# Altium schematic sheet 45-RELAY_MUX_SWITCH.SchDoc
size 594 x 420 mm
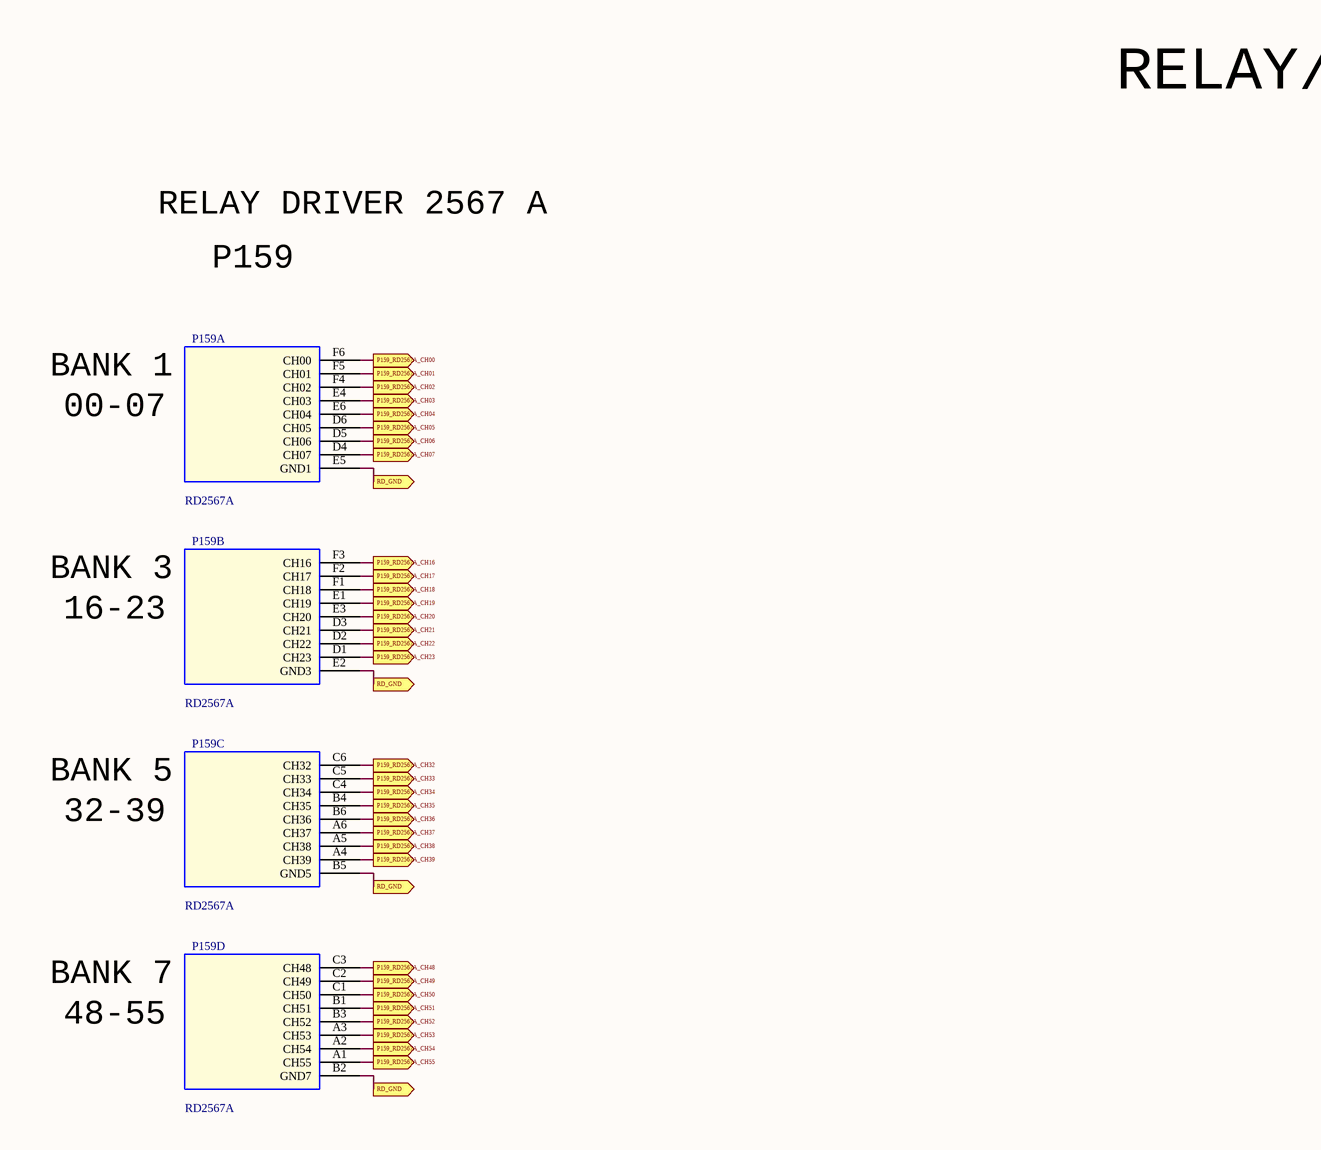
[diagram p0: 45-RELAY_MUX_SWITCH.SchDoc, top left]
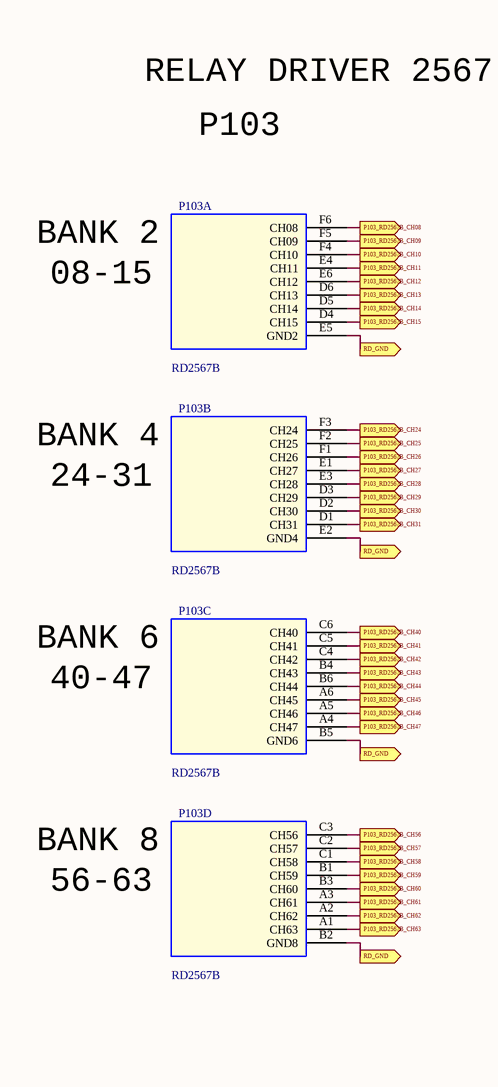
[diagram p1: 45-RELAY_MUX_SWITCH.SchDoc, bottom left]
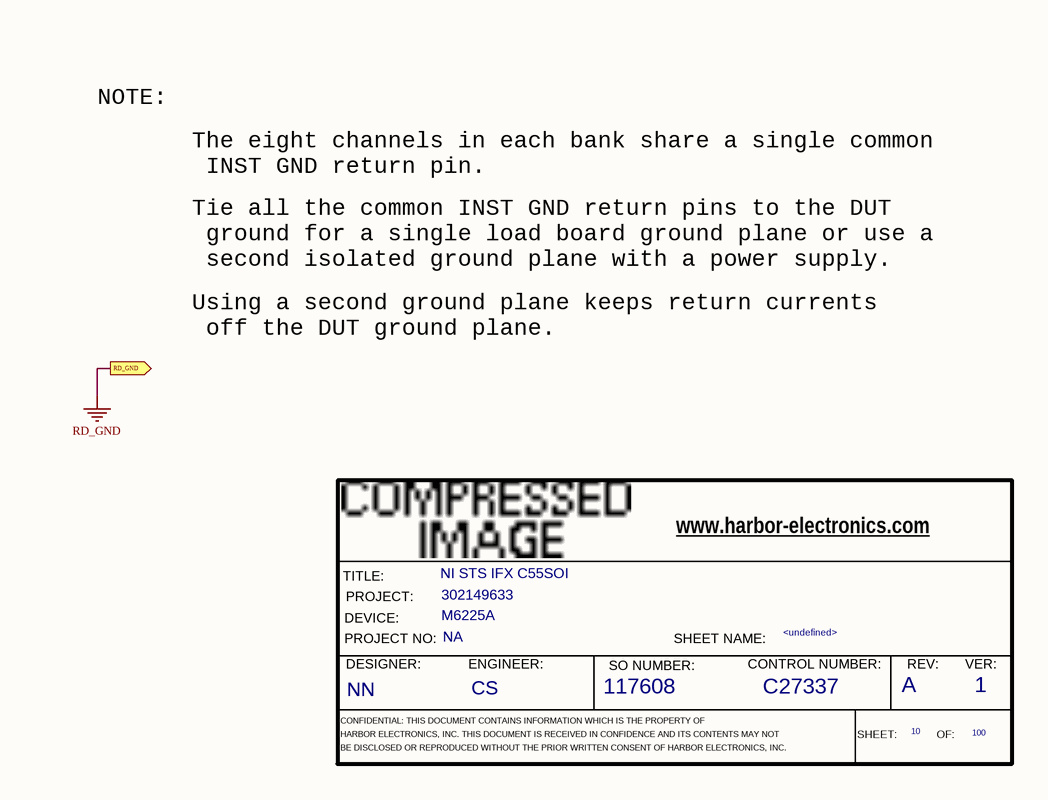
[diagram p2: 45-RELAY_MUX_SWITCH.SchDoc, bottom right]

## Parts
*  RevCode: A  Title: NI STS IFX C55SOI  Page Number: 10  Page Count: 100  Engineer: CS  Designer: NN  SO Number: 117608  Control Number: C27337  Version: 1  Page Name: <undefined>  PROJECT: 302149633  DEVICE: M6225A  PROJECT NO.: NA  (hidden comment: HE_DEFAULT)  (graphical)
P103  RD2567B  [285092A-08_36PIN]  (parts A,B,C,D of 4)
P159  RD2567A  [285092A-08_36PIN]  (parts A,B,C,D of 4)

## Ports
P103_RD2567B_CH08 (out), P103_RD2567B_CH09 (out), P103_RD2567B_CH10 (out), P103_RD2567B_CH11 (out), P103_RD2567B_CH12 (out), P103_RD2567B_CH13 (out), P103_RD2567B_CH14 (out), P103_RD2567B_CH15 (out), P103_RD2567B_CH24 (out), P103_RD2567B_CH25 (out), P103_RD2567B_CH26 (out), P103_RD2567B_CH27 (out), P103_RD2567B_CH28 (out), P103_RD2567B_CH29 (out), P103_RD2567B_CH30 (out), P103_RD2567B_CH31 (out), P103_RD2567B_CH40 (out), P103_RD2567B_CH41 (out), P103_RD2567B_CH42 (out), P103_RD2567B_CH43 (out), P103_RD2567B_CH44 (out), P103_RD2567B_CH45 (out), P103_RD2567B_CH46 (out), P103_RD2567B_CH47 (out), P103_RD2567B_CH56 (out), P103_RD2567B_CH57 (out), P103_RD2567B_CH58 (out), P103_RD2567B_CH59 (out), P103_RD2567B_CH60 (out), P103_RD2567B_CH61 (out), P103_RD2567B_CH62 (out), P103_RD2567B_CH63 (out), P159_RD2567A_CH00 (out), P159_RD2567A_CH01 (out), P159_RD2567A_CH02 (out), P159_RD2567A_CH03 (out), P159_RD2567A_CH04 (out), P159_RD2567A_CH05 (out), P159_RD2567A_CH06 (out), P159_RD2567A_CH07 (out), P159_RD2567A_CH16 (out), P159_RD2567A_CH17 (out), P159_RD2567A_CH18 (out), P159_RD2567A_CH19 (out), P159_RD2567A_CH20 (out), P159_RD2567A_CH21 (out), P159_RD2567A_CH22 (out), P159_RD2567A_CH23 (out), P159_RD2567A_CH32 (out), P159_RD2567A_CH33 (out), P159_RD2567A_CH34 (out), P159_RD2567A_CH35 (out), P159_RD2567A_CH36 (out), P159_RD2567A_CH37 (out), P159_RD2567A_CH38 (out), P159_RD2567A_CH39 (out), P159_RD2567A_CH48 (out), P159_RD2567A_CH49 (out), P159_RD2567A_CH50 (out), P159_RD2567A_CH51 (out), P159_RD2567A_CH52 (out), P159_RD2567A_CH53 (out), P159_RD2567A_CH54 (out), P159_RD2567A_CH55 (out), RD_GND (out)

## Nets
RD_GND: P103.B2(GND8) P103.B5(GND6) P103.E2(GND4) P103.E5(GND2) P159.B2(GND7) P159.B5(GND5) P159.E2(GND3) P159.E5(GND1) ; port RD_GND
P103_RD2567B_CH08: P103.F6(CH08) ; port P103_RD2567B_CH08
P103_RD2567B_CH09: P103.F5(CH09) ; port P103_RD2567B_CH09
P103_RD2567B_CH10: P103.F4(CH10) ; port P103_RD2567B_CH10
P103_RD2567B_CH11: P103.E4(CH11) ; port P103_RD2567B_CH11
P103_RD2567B_CH12: P103.E6(CH12) ; port P103_RD2567B_CH12
P103_RD2567B_CH13: P103.D6(CH13) ; port P103_RD2567B_CH13
P103_RD2567B_CH14: P103.D5(CH14) ; port P103_RD2567B_CH14
P103_RD2567B_CH15: P103.D4(CH15) ; port P103_RD2567B_CH15
P103_RD2567B_CH24: P103.F3(CH24) ; port P103_RD2567B_CH24
P103_RD2567B_CH25: P103.F2(CH25) ; port P103_RD2567B_CH25
P103_RD2567B_CH26: P103.F1(CH26) ; port P103_RD2567B_CH26
P103_RD2567B_CH27: P103.E1(CH27) ; port P103_RD2567B_CH27
P103_RD2567B_CH28: P103.E3(CH28) ; port P103_RD2567B_CH28
P103_RD2567B_CH29: P103.D3(CH29) ; port P103_RD2567B_CH29
P103_RD2567B_CH30: P103.D2(CH30) ; port P103_RD2567B_CH30
P103_RD2567B_CH31: P103.D1(CH31) ; port P103_RD2567B_CH31
P103_RD2567B_CH40: P103.C6(CH40) ; port P103_RD2567B_CH40
P103_RD2567B_CH41: P103.C5(CH41) ; port P103_RD2567B_CH41
P103_RD2567B_CH42: P103.C4(CH42) ; port P103_RD2567B_CH42
P103_RD2567B_CH43: P103.B4(CH43) ; port P103_RD2567B_CH43
P103_RD2567B_CH44: P103.B6(CH44) ; port P103_RD2567B_CH44
P103_RD2567B_CH45: P103.A6(CH45) ; port P103_RD2567B_CH45
P103_RD2567B_CH46: P103.A5(CH46) ; port P103_RD2567B_CH46
P103_RD2567B_CH47: P103.A4(CH47) ; port P103_RD2567B_CH47
P103_RD2567B_CH56: P103.C3(CH56) ; port P103_RD2567B_CH56
P103_RD2567B_CH57: P103.C2(CH57) ; port P103_RD2567B_CH57
P103_RD2567B_CH58: P103.C1(CH58) ; port P103_RD2567B_CH58
P103_RD2567B_CH59: P103.B1(CH59) ; port P103_RD2567B_CH59
P103_RD2567B_CH60: P103.B3(CH60) ; port P103_RD2567B_CH60
P103_RD2567B_CH61: P103.A3(CH61) ; port P103_RD2567B_CH61
P103_RD2567B_CH62: P103.A2(CH62) ; port P103_RD2567B_CH62
P103_RD2567B_CH63: P103.A1(CH63) ; port P103_RD2567B_CH63
P159_RD2567A_CH00: P159.F6(CH00) ; port P159_RD2567A_CH00
P159_RD2567A_CH01: P159.F5(CH01) ; port P159_RD2567A_CH01
P159_RD2567A_CH02: P159.F4(CH02) ; port P159_RD2567A_CH02
P159_RD2567A_CH03: P159.E4(CH03) ; port P159_RD2567A_CH03
P159_RD2567A_CH04: P159.E6(CH04) ; port P159_RD2567A_CH04
P159_RD2567A_CH05: P159.D6(CH05) ; port P159_RD2567A_CH05
P159_RD2567A_CH06: P159.D5(CH06) ; port P159_RD2567A_CH06
P159_RD2567A_CH07: P159.D4(CH07) ; port P159_RD2567A_CH07
P159_RD2567A_CH16: P159.F3(CH16) ; port P159_RD2567A_CH16
P159_RD2567A_CH17: P159.F2(CH17) ; port P159_RD2567A_CH17
P159_RD2567A_CH18: P159.F1(CH18) ; port P159_RD2567A_CH18
P159_RD2567A_CH19: P159.E1(CH19) ; port P159_RD2567A_CH19
P159_RD2567A_CH20: P159.E3(CH20) ; port P159_RD2567A_CH20
P159_RD2567A_CH21: P159.D3(CH21) ; port P159_RD2567A_CH21
P159_RD2567A_CH22: P159.D2(CH22) ; port P159_RD2567A_CH22
P159_RD2567A_CH23: P159.D1(CH23) ; port P159_RD2567A_CH23
P159_RD2567A_CH32: P159.C6(CH32) ; port P159_RD2567A_CH32
P159_RD2567A_CH33: P159.C5(CH33) ; port P159_RD2567A_CH33
P159_RD2567A_CH34: P159.C4(CH34) ; port P159_RD2567A_CH34
P159_RD2567A_CH35: P159.B4(CH35) ; port P159_RD2567A_CH35
P159_RD2567A_CH36: P159.B6(CH36) ; port P159_RD2567A_CH36
P159_RD2567A_CH37: P159.A6(CH37) ; port P159_RD2567A_CH37
P159_RD2567A_CH38: P159.A5(CH38) ; port P159_RD2567A_CH38
P159_RD2567A_CH39: P159.A4(CH39) ; port P159_RD2567A_CH39
P159_RD2567A_CH48: P159.C3(CH48) ; port P159_RD2567A_CH48
P159_RD2567A_CH49: P159.C2(CH49) ; port P159_RD2567A_CH49
P159_RD2567A_CH50: P159.C1(CH50) ; port P159_RD2567A_CH50
P159_RD2567A_CH51: P159.B1(CH51) ; port P159_RD2567A_CH51
P159_RD2567A_CH52: P159.B3(CH52) ; port P159_RD2567A_CH52
P159_RD2567A_CH53: P159.A3(CH53) ; port P159_RD2567A_CH53
P159_RD2567A_CH54: P159.A2(CH54) ; port P159_RD2567A_CH54
P159_RD2567A_CH55: P159.A1(CH55) ; port P159_RD2567A_CH55

## Notes on the sheet
- RELAY/MUX/SWITCH
- RELAY DRIVER 2567 A
- P159
- BANK 1
- 00-07
- BANK 3
- 16-23
- BANK 5
- 32-39
- BANK 7
- 48-55
- RELAY DRIVER 2567 B
- P103
- BANK 2
- 08-15
- BANK 4
- NOTE:
- The eight channels in each bank share a single common
  INST GND return pin.
- 24-31
- Tie all the common INST GND return pins to the DUT
  ground for a single load board ground plane or use a
  second isolated ground plane with a power supply.
- BANK 6
- Using a second ground plane keeps return currents
  off the DUT ground plane.
- 40-47
- BANK 8
- 56-63
- (in symbol HE_DEFAULT) www.harbor-electronics.com; TITLE:; PROJECT:; DEVICE:; PROJECT NO:; SHEET NAME:; DESIGNER:; ENGINEER:; SO NUMBER:; CONTROL NUMBER:; REV:; VER:; CONFIDENTIAL: THIS DOCUMENT CONTAINS INFORMATION WHICH IS THE PROPERTY OF; HARBOR ELECTRONICS, INC. THIS DOCUMENT IS RECEIVED IN CONFIDENCE AND ITS CONTENTS MAY NOT; SHEET:; OF:; BE DISCLOSED OR REPRODUCED WITHOUT THE PRIOR WRITTEN CONSENT OF HARBOR ELECTRONICS, INC.

## Library data of the parts
* = HE_DEFAULT: Page Size: X; OrgAddr4: Fax: +1 602-431-9633; OrgAddr1: 4050 E. Cotton Center Blvd., Suite 33; OrgAddr2: Phoenix, Arizona 85040 U.S.A.; OrgAddr3: Phone: +1 602-438-1112; Doc: <Title Name>; OrgName: HARBOR
P103 = RD2567B: SPLIT_INST: TRUE; SWAP_INFO: (S1+S2+S3+S4); PCB Footprint: 285092A-08_36PIN
P159 = RD2567A: SPLIT_INST: TRUE; SWAP_INFO: (S1+S2+S3+S4); PCB Footprint: 285092A-08_36PIN